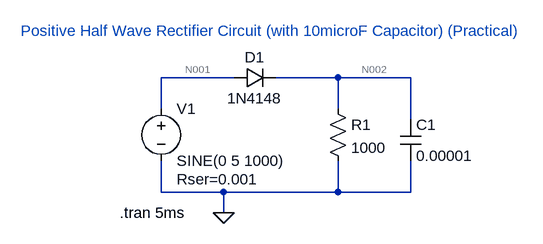
[diagram p0: schematic Assignment 3a (vi).asc]
Assignment 3a (vi).asc, the LTspice schematic file:
Version 4.1
SHEET 1 880 680
WIRE 304 80 192 80
WIRE 464 80 368 80
WIRE 576 80 464 80
WIRE 192 128 192 80
WIRE 464 128 464 80
WIRE 576 144 576 80
WIRE 192 256 192 208
WIRE 288 256 192 256
WIRE 464 256 464 208
WIRE 464 256 288 256
WIRE 576 256 576 208
WIRE 576 256 464 256
WIRE 288 288 288 256
FLAG 288 288 0
SYMBOL voltage 192 112 R0
WINDOW 123 0 0 Left 2
WINDOW 39 24 124 Left 2
SYMATTR SpiceLine Rser=0.001
SYMATTR InstName V1
SYMATTR Value SINE(0 5 1000)
SYMBOL res 448 112 R0
SYMATTR InstName R1
SYMATTR Value 1000
SYMBOL diode 304 96 R270
WINDOW 0 32 32 VTop 2
WINDOW 3 0 32 VBottom 2
SYMATTR InstName D1
SYMATTR Value 1N4148
SYMBOL cap 560 144 R0
SYMATTR InstName C1
SYMATTR Value 0.00001
TEXT 128 288 Left 2 !.tran 5ms
TEXT -24 8 Left 2 ;Positive Half Wave Rectifier Circuit (with 10microF Capacitor) (Practical)

The netlist it stands for:
* Assignment 3a (vi).asc
V1 N001 0 SINE(0 5 1000) Rser=0.001
R1 N002 0 1000
D1 N001 N002 1N4148
C1 N002 0 0.00001
.model D D
.lib standard.dio
.tran 5ms
* Positive Half Wave Rectifier Circuit (with 10microF Capacitor) (Practical)
.backanno
.end

* Results of the author's LTspice run, read from the files saved beside the schematic
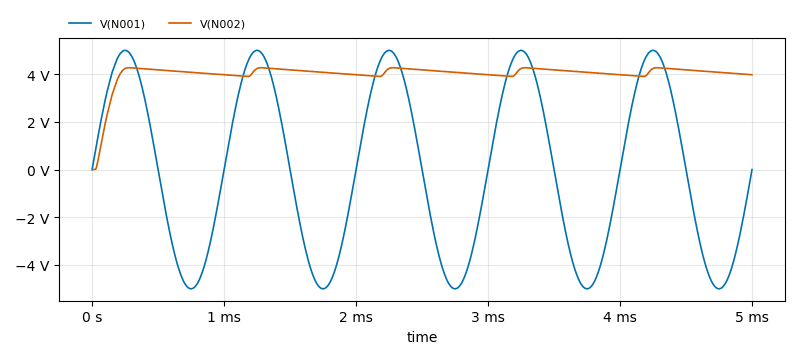
[diagram p1: Transient Analysis of Assignment 3a (vi).asc, plotted from the saved traces]
* Transient Analysis, 1 run:
*   V(N001): min -5 V, max 5 V, average -405.2 µV, rms 3.535 V, last 0 V
*   V(N002): min 0 V, max 4.273 V, average 4.008 V, rms 4.042 V, last 3.978 V